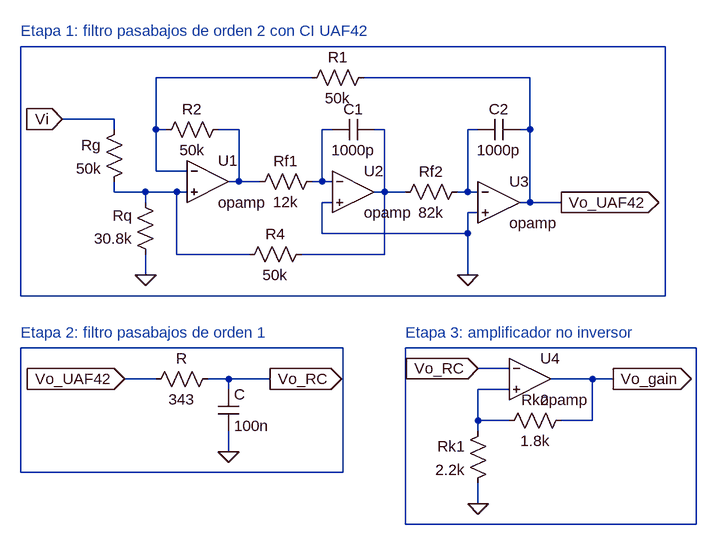
[diagram p0: schematic diagbloq.asc]
diagbloq.asc, the LTspice schematic file:
Version 4
SHEET 1 908 692
WIRE 832 -48 -160 -48
WIRE 288 0 48 0
WIRE 624 0 368 0
WIRE -16 64 -96 64
WIRE -16 80 -16 64
WIRE 48 80 48 0
WIRE 64 80 48 80
WIRE 176 80 144 80
WIRE 320 80 304 80
WIRE 400 80 384 80
WIRE 544 80 528 80
WIRE 624 80 624 0
WIRE 624 80 608 80
WIRE 48 144 48 80
WIRE 96 144 48 144
WIRE 176 160 176 80
WIRE 176 160 160 160
WIRE 208 160 176 160
WIRE 304 160 304 80
WIRE 304 160 288 160
WIRE 320 160 304 160
WIRE -16 176 -16 160
WIRE 32 176 -16 176
WIRE 80 176 32 176
WIRE 96 176 80 176
WIRE 400 176 400 80
WIRE 400 176 384 176
WIRE 432 176 400 176
WIRE 528 176 528 80
WIRE 528 176 512 176
WIRE 544 176 528 176
WIRE 32 192 32 176
WIRE 320 192 304 192
WIRE 624 192 624 80
WIRE 624 192 608 192
WIRE 672 192 624 192
WIRE 544 208 528 208
WIRE 304 240 304 192
WIRE 528 240 528 208
WIRE 528 240 304 240
WIRE 80 272 80 176
WIRE 192 272 80 272
WIRE 400 272 400 176
WIRE 400 272 272 272
WIRE 32 304 32 272
WIRE 528 304 528 240
WIRE -160 336 -160 -48
WIRE 832 336 832 -48
WIRE 832 336 -160 336
WIRE 336 416 -160 416
WIRE 880 416 432 416
WIRE 592 448 544 448
WIRE 48 464 0 464
WIRE 160 464 128 464
WIRE 224 464 160 464
WIRE 720 464 656 464
WIRE 752 464 720 464
WIRE 160 480 160 464
WIRE 592 480 544 480
WIRE 544 528 544 480
WIRE 592 528 544 528
WIRE 720 528 720 464
WIRE 720 528 672 528
WIRE 544 544 544 528
WIRE 160 576 160 544
WIRE -160 608 -160 416
WIRE 336 608 336 416
WIRE 336 608 -160 608
WIRE 544 656 544 624
WIRE 432 688 432 416
WIRE 880 688 880 416
WIRE 880 688 432 688
FLAG 528 304 0
FLAG 32 304 0
FLAG -96 64 Vi
IOPIN -96 64 In
FLAG 672 192 Vo_UAF42
IOPIN 672 192 Out
FLAG 0 464 Vo_UAF42
IOPIN 0 464 In
FLAG 160 576 0
FLAG 224 464 Vo_RC
IOPIN 224 464 Out
FLAG 544 656 0
FLAG 752 464 Vo_gain
IOPIN 752 464 Out
FLAG 544 448 Vo_RC
IOPIN 544 448 In
SYMBOL OpAmps\\opamp 128 96 R0
SYMATTR InstName U1
SYMBOL OpAmps\\opamp 352 112 R0
SYMATTR InstName U2
SYMBOL OpAmps\\opamp 576 128 R0
SYMATTR InstName U3
SYMBOL res 304 144 R90
WINDOW 0 0 56 VBottom 2
WINDOW 3 32 56 VTop 2
SYMATTR InstName Rf1
SYMATTR Value 12k
SYMBOL res 528 160 R90
WINDOW 0 0 56 VBottom 2
WINDOW 3 32 56 VTop 2
SYMATTR InstName Rf2
SYMATTR Value 82k
SYMBOL res 160 64 R90
WINDOW 0 0 56 VBottom 2
WINDOW 3 32 56 VTop 2
SYMATTR InstName R2
SYMATTR Value 50k
SYMBOL cap 384 64 R90
WINDOW 0 0 32 VBottom 2
WINDOW 3 32 32 VTop 2
SYMATTR InstName C1
SYMATTR Value 1000p
SYMBOL cap 608 64 R90
WINDOW 0 0 32 VBottom 2
WINDOW 3 32 32 VTop 2
SYMATTR InstName C2
SYMATTR Value 1000p
SYMBOL res 384 -16 R90
WINDOW 0 0 56 VBottom 2
WINDOW 3 32 56 VTop 2
SYMATTR InstName R1
SYMATTR Value 50k
SYMBOL res 288 256 R90
WINDOW 0 0 56 VBottom 2
WINDOW 3 32 56 VTop 2
SYMATTR InstName R4
SYMATTR Value 50k
SYMBOL res 48 288 R180
WINDOW 0 36 76 Left 2
WINDOW 3 36 40 Left 2
SYMATTR InstName Rq
SYMATTR Value 30.8k
SYMBOL res 0 64 M0
SYMATTR InstName Rg
SYMATTR Value 50k
SYMBOL res 144 448 R90
WINDOW 0 0 56 VBottom 2
WINDOW 3 32 56 VTop 2
SYMATTR InstName R
SYMATTR Value 343
SYMBOL cap 144 480 R0
SYMATTR InstName C
SYMATTR Value 100n
SYMBOL OpAmps\\opamp 624 400 R0
SYMATTR InstName U4
SYMBOL res 560 528 M0
SYMATTR InstName Rk1
SYMATTR Value 2.2k
SYMBOL res 688 512 R90
WINDOW 0 0 56 VBottom 2
WINDOW 3 32 56 VTop 2
SYMATTR InstName Rk2
SYMATTR Value 1.8k
TEXT -160 -72 Left 2 ;Etapa 1: filtro pasabajos de orden 2 con CI UAF42
TEXT -160 392 Left 2 ;Etapa 2: filtro pasabajos de orden 1
TEXT 432 392 Left 2 ;Etapa 3: amplificador no inversor

The netlist it stands for:
* diagbloq.asc
XU1 N002 N007 N003 opamp Aol=100K GBW=10Meg  ; pins invin noninvin out
XU2 N004 0 N005 opamp Aol=100K GBW=10Meg  ; pins invin noninvin out
XU3 N006 0 Vo_UAF42 opamp Aol=100K GBW=10Meg  ; pins invin noninvin out
Rf1 N004 N003 12k
Rf2 N006 N005 82k
R2 N003 N002 50k
C1 N005 N004 1000p
C2 Vo_UAF42 N006 1000p
R1 Vo_UAF42 N002 50k
R4 N005 N007 50k
Rq 0 N007 30.8k
Rg Vi N007 50k
R Vo_RC Vo_UAF42 343
C Vo_RC 0 100n
XU4 Vo_RC N010 Vo_gain opamp Aol=100K GBW=10Meg  ; pins invin noninvin out
Rk1 N010 0 2.2k
Rk2 Vo_gain N010 1.8k
* Etapa 1: filtro pasabajos de orden 2 con CI UAF42
* Etapa 2: filtro pasabajos de orden 1
* Etapa 3: amplificador no inversor
.backanno
.end